# EAGLE schematic ESP32_circuit (EAGLE 9.7.0)

## Sheet 1 of 2
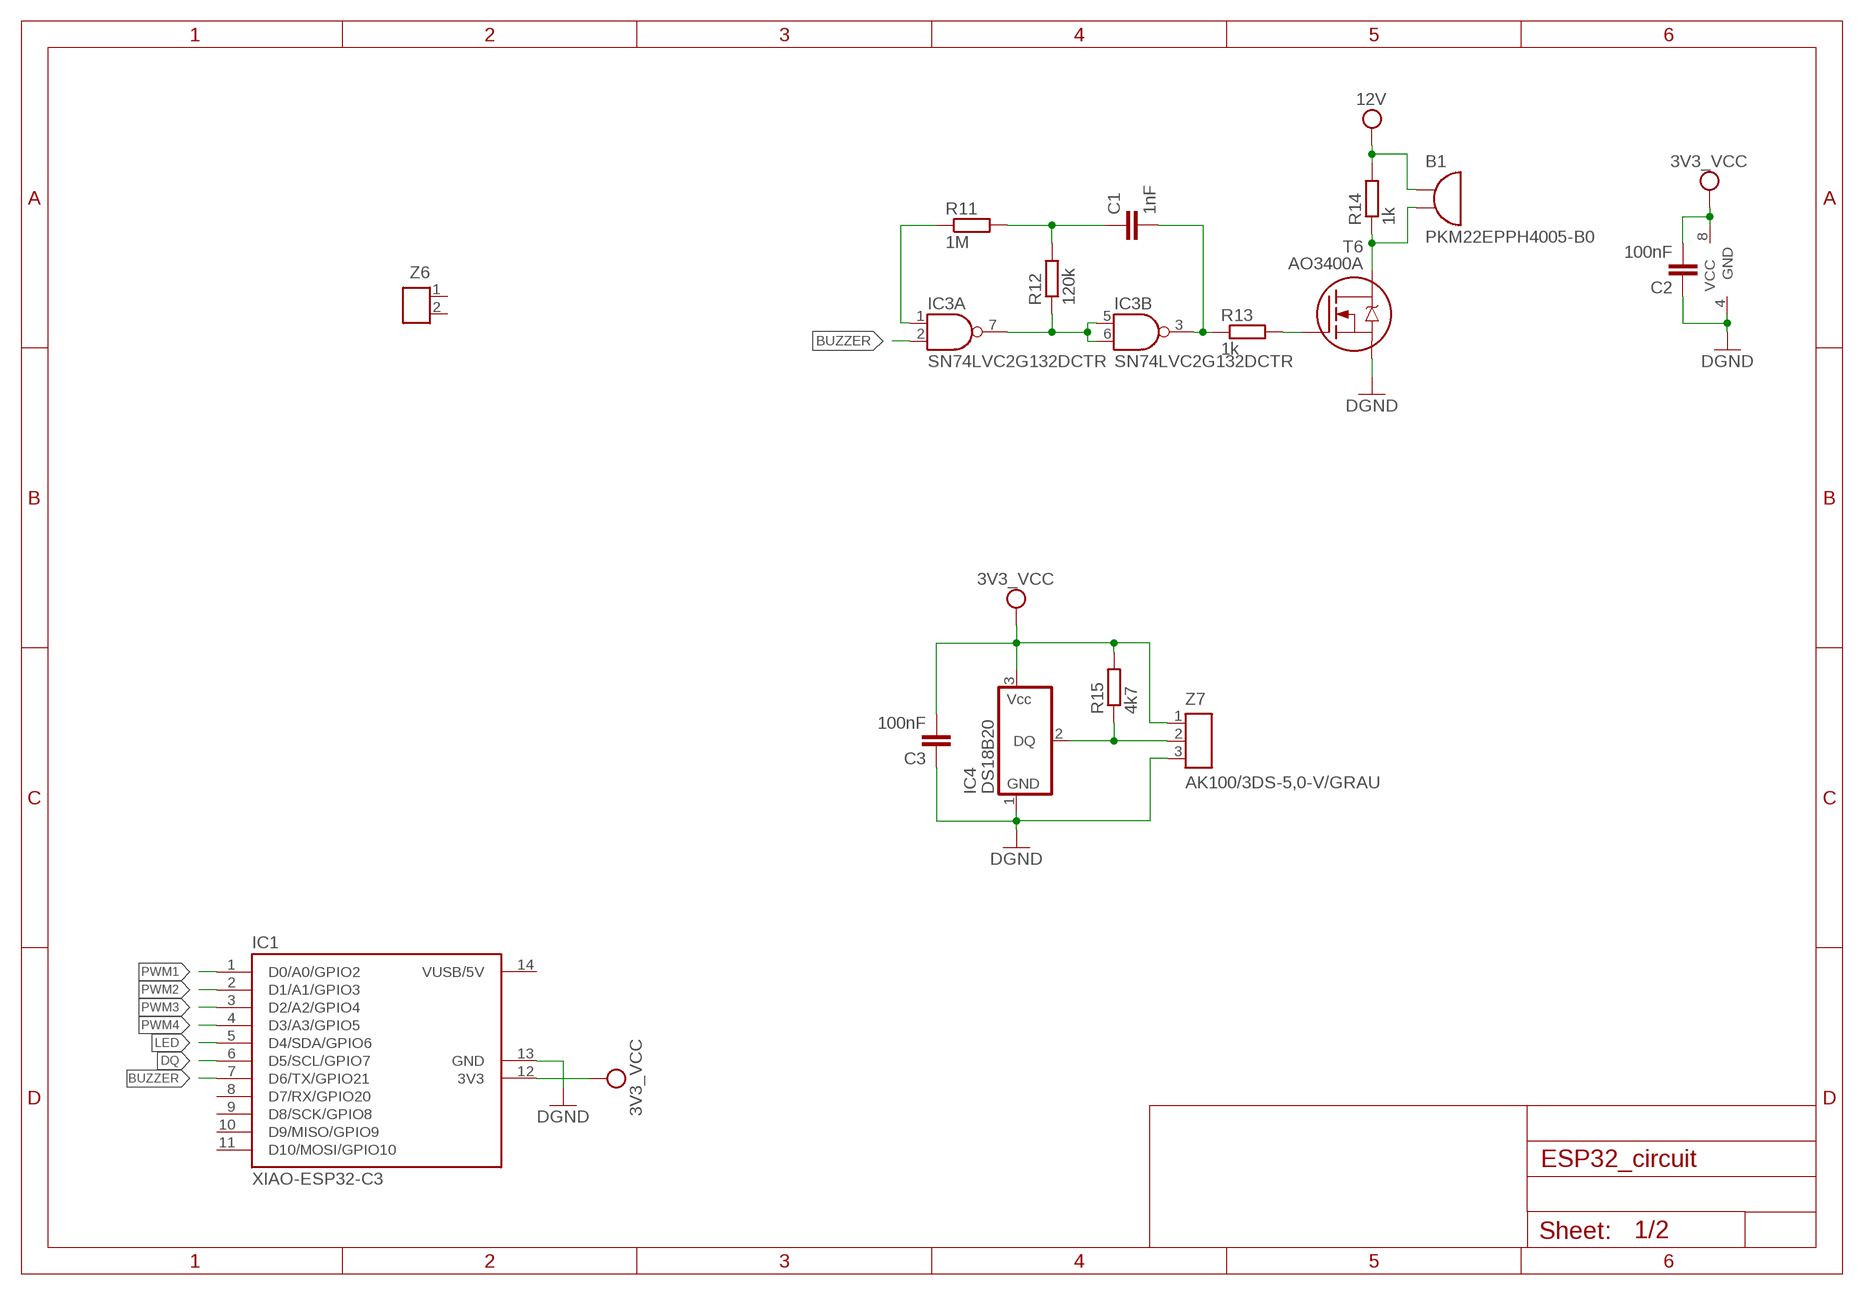
[diagram p0: schematic, sheet 1]

### Parts
B1  PKM22EPPH4005-B0  [PKM22EPPH4005]
C1  1nF  C-EUC0805  [C0805]
C2  100nF  C-EUC0805  [C0805]
C3  100nF  C-EUC0805  [C0805]
IC1  XIAO-ESP32-C3  [XIAO-ESP32-C3]
IC3  SN74LVC2G132DCTR  [DCT0008A_SM8]
IC4  DS18B20  [TO92]
R11  1M  R-EU_R0805  [R0805]
R12  120k  R-EU_R0805  [R0805]
R13  1k  R-EU_R0805  [R0805]
R14  1k  R-EU_R0805  [R0805]
R15  4k7  R-EU_R0805  [R0805]
T6  AO3400A  [SOT23]
Z6  AK100/2DS-5,0-V/GRAU  [AK100/2DS-5,0-V/GRAU_V2]
Z7  AK100/3DS-5,0-V/GRAU  [AK100/3DS-5,0-V/GRAU_V2]

### Nets
3V3_VCC: C2.2 C3.2 IC1.12(3V3) IC3.8(VCC) IC4.3(VCC) R15.2 Z7.1
12V: B1.1 R14.2 ; also sheet 2
BUZZER: IC1.7(D6/TX/GPIO21) IC3.2(A:B)
DGND: C2.1 C3.1 IC1.13(GND) IC3.4(GND) IC4.1(GND) T6.2(S) Z7.3 ; also sheet 2
DQ: IC1.6(D5/SCL/GPIO7) IC4.2(DQ) R15.1 Z7.2
LED: IC1.5(D4/SDA/GPIO6)
N$11: IC3.5(B:A) IC3.6(B:B) IC3.7(A:Y) R12.1
N$13: IC3.1(A:A) R11.1
N$14: C1.1 R11.2 R12.2
N$15: C1.2 IC3.3(B:Y) R13.1
PWM1: IC1.1(D0/A0/GPIO2)
PWM2: IC1.2(D1/A1/GPIO3)
PWM3: IC1.3(D2/A2/GPIO4)
PWM4: IC1.4(D3/A3/GPIO5)
T6_D: B1.2 R14.1 T6.3(D)
T6_G: R13.2 T6.1(G)
Unconnected: IC1.8(D7/RX/GPIO20) IC1.9(D8/SCK/GPIO8) IC1.10(D9/MISO/GPIO9) IC1.11(D10/MOSI/GPIO10) Z6.1 Z6.2

## Sheet 2 of 2
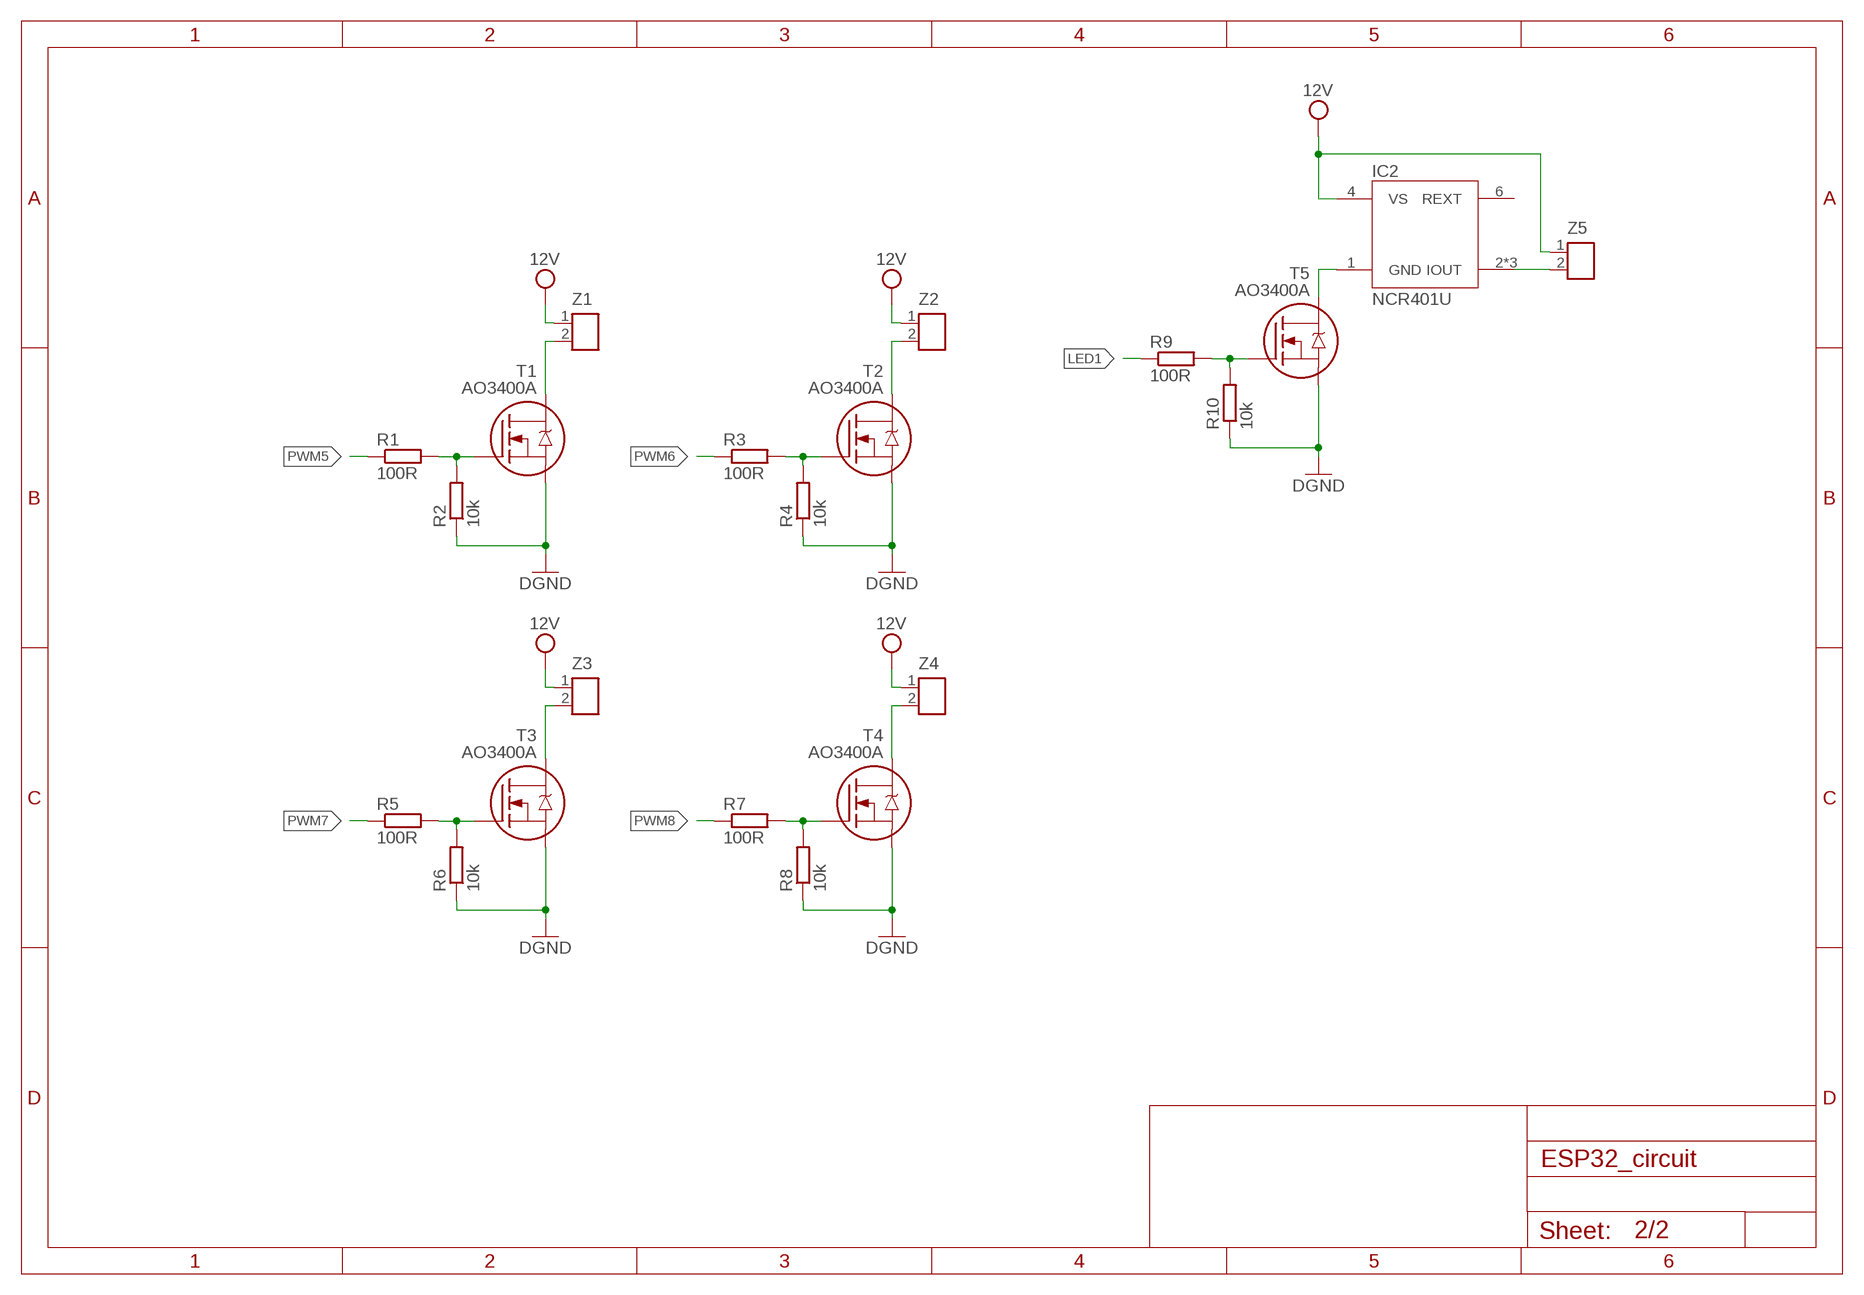
[diagram p1: schematic, sheet 2]

### Parts
IC2  NCR401U  [SOT457]
R1  100R  R-EU_R0805  [R0805]
R2  10k  R-EU_R0805  [R0805]
R3  100R  R-EU_R0805  [R0805]
R4  10k  R-EU_R0805  [R0805]
R5  100R  R-EU_R0805  [R0805]
R6  10k  R-EU_R0805  [R0805]
R7  100R  R-EU_R0805  [R0805]
R8  10k  R-EU_R0805  [R0805]
R9  100R  R-EU_R0805  [R0805]
R10  10k  R-EU_R0805  [R0805]
T1  AO3400A  [SOT23]
T2  AO3400A  [SOT23]
T3  AO3400A  [SOT23]
T4  AO3400A  [SOT23]
T5  AO3400A  [SOT23]
Z1  AK100/2DS-5,0-V/GRAU  [AK100/2DS-5,0-V/GRAU_V2]
Z2  AK100/2DS-5,0-V/GRAU  [AK100/2DS-5,0-V/GRAU_V2]
Z3  AK100/2DS-5,0-V/GRAU  [AK100/2DS-5,0-V/GRAU_V2]
Z4  AK100/2DS-5,0-V/GRAU  [AK100/2DS-5,0-V/GRAU_V2]
Z5  AK100/2DS-5,0-V/GRAU  [AK100/2DS-5,0-V/GRAU_V2]

### Nets
12V: IC2.4(VS) Z1.1 Z2.1 Z3.1 Z4.1 Z5.1 ; also sheet 1
DGND: R2.1 R4.1 R6.1 R8.1 R10.1 T1.2(S) T2.2(S) T3.2(S) T4.2(S) T5.2(S) ; also sheet 1
LED1: R9.1
LED_OUTPUT: IC2.2(IOUT) IC2.3(IOUT) IC2.5(IOUT) Z5.2
PWM5: R1.1
PWM6: R3.1
PWM7: R5.1
PWM8: R7.1
T1_D: T1.3(D) Z1.2
T1_G: R1.2 R2.2 T1.1(G)
T2_D: T2.3(D) Z2.2
T2_G: R3.2 R4.2 T2.1(G)
T3_D: T3.3(D) Z3.2
T3_G: R5.2 R6.2 T3.1(G)
T4_D: T4.3(D) Z4.2
T4_G: R7.2 R8.2 T4.1(G)
T5_D: IC2.1(GND) T5.3(D)
T5_G: R9.2 R10.2 T5.1(G)
Unconnected: IC2.6(REXT)

## Power pins joined to a net without a drawn wire
VUSB/5V: IC1.14(VUSB/5V)

## Library data of the parts
B1 = !KASIOR_3:PKM22EPPH4005-B0
C1-C3 = rcl:C-EU: CAPACITOR, European symbol
IC1 = !KASIOR_3:XIAO-ESP32-C3
IC2 = !KASIOR_3:NCR401U
IC3 = !KASIOR_3:SN74LVC2G132DCTR
IC4 = !KASIOR_3:DS18B20?: DS18B20 Programmable Resolution 1-Wire Digital Thermometer DS18B20 datasheets.maximintegrated.com/en/ds/DS18B20.pdf © Michał Kasior
R1-R15 = rcl:R-EU_: RESISTOR, European symbol
T1-T6 = !KASIOR_3:AO3400A
Z1-Z6 = !KASIOR_3:AK100/2DS-5,0-V/GRAU: Listwa zaciskowa TB-5.0-P-3P Raster 5mm; kątowe; 2,5mm2; THT, zaciski śrubowe; tory:3 http://www.tme.eu/dok/T/tb-50-p-2p.pdf © Michał Kasior
Z7 = !KASIOR_3:AK100/3DS-5,0-V/GRAU: Listwa zaciskowa TB-5.0-P-3P Raster 5mm; kątowe; 2,5mm2; THT, zaciski śrubowe; tory:3 http://www.tme.eu/dok/T/tb-50-p-2p.pdf © Michał Kasior